# EAGLE schematic AcquisitionExpansionModule (EAGLE 6.6.0)
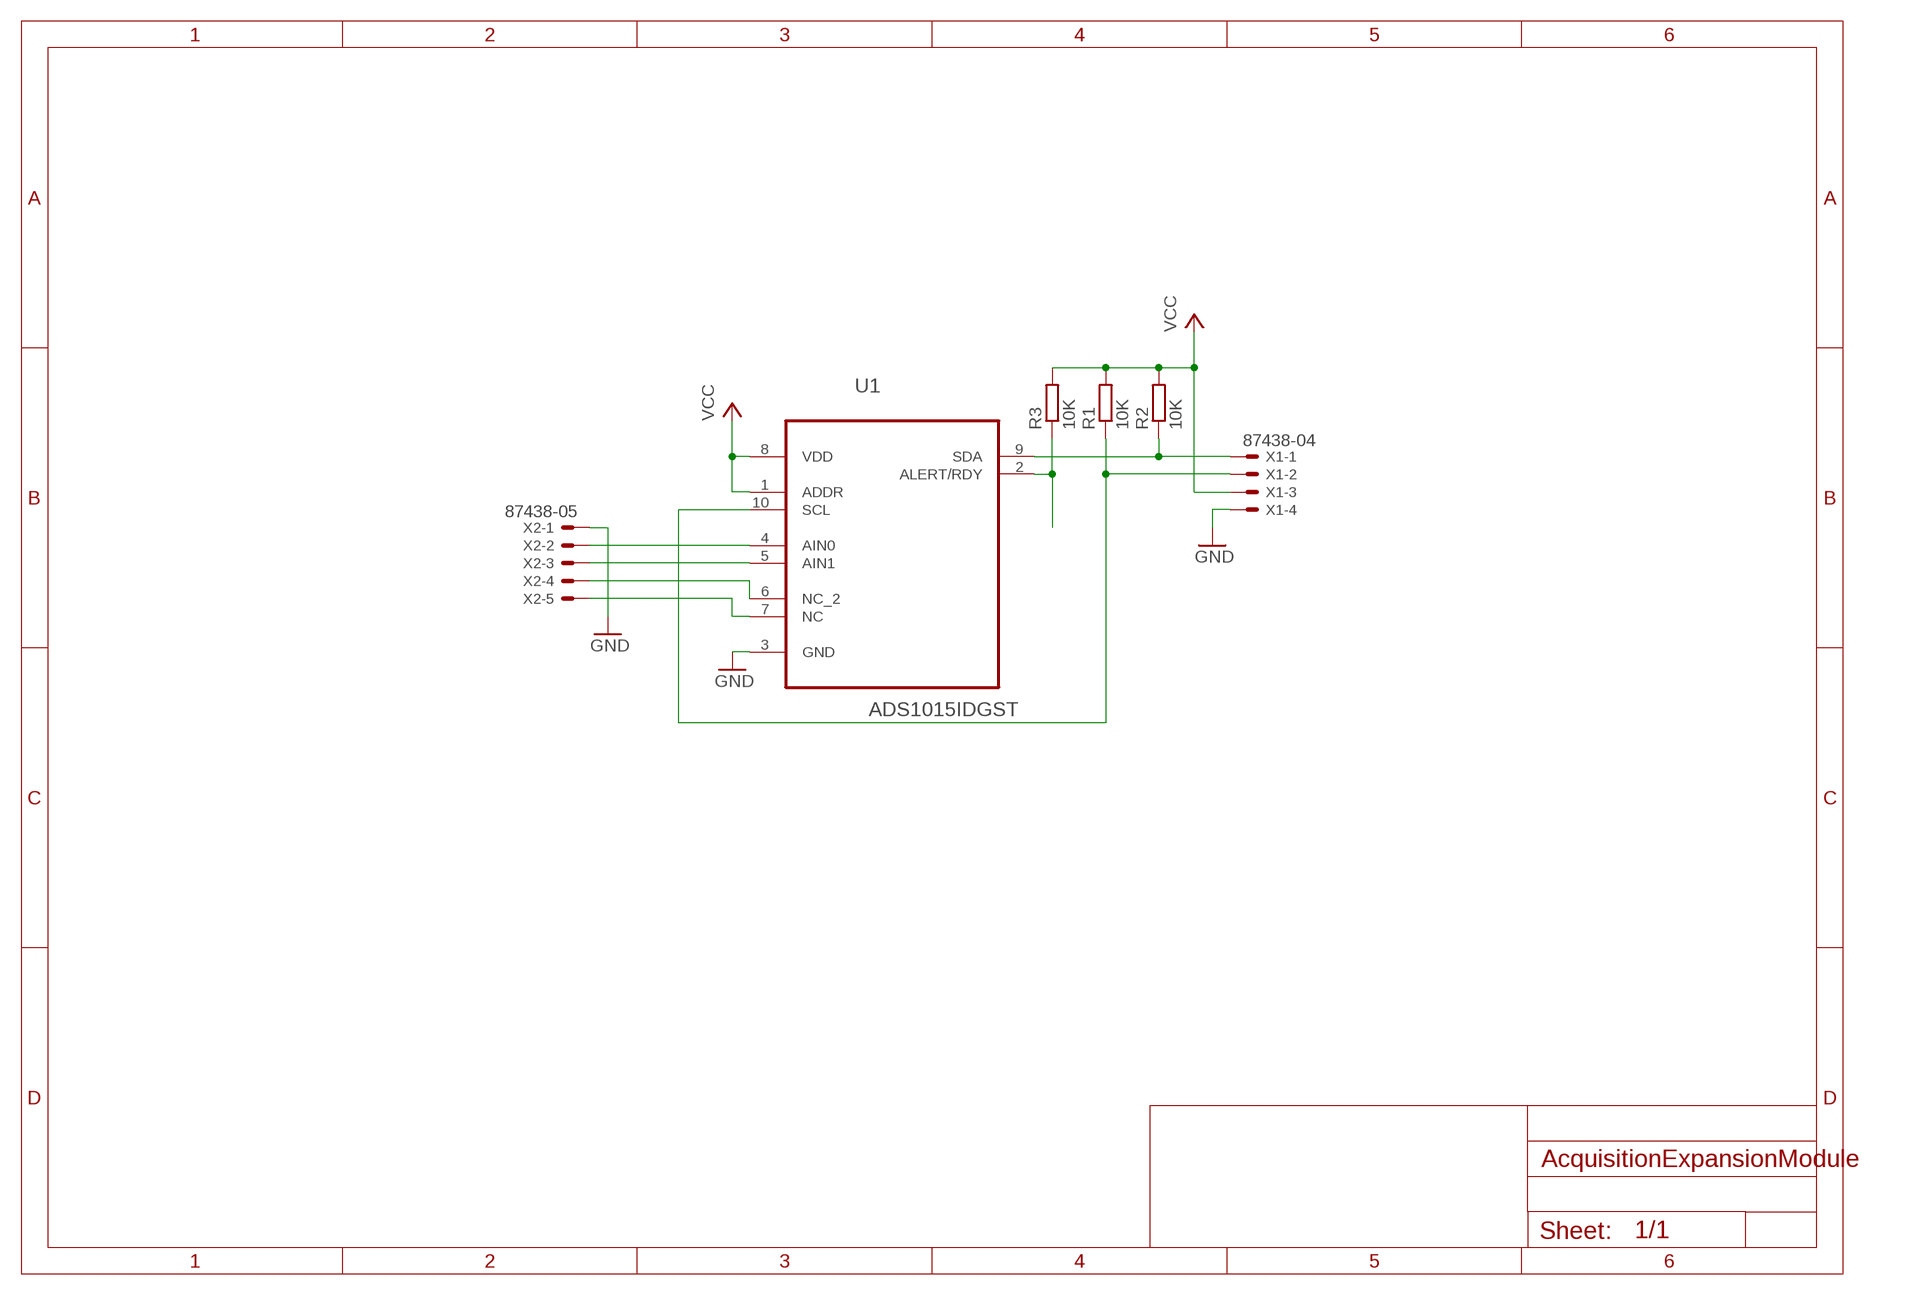
[diagram p0: schematic, sheet 1]

## Parts
R1  10K  R-EU_MELF0102W  [MINI_MELF-0102W]
R2  10K  R-EU_MELF0102W  [MINI_MELF-0102W]
R3  10K  R-EU_MELF0102W  [MINI_MELF-0102W]
U1  ADS1015IDGST  [SOP50P490X110-10N]
X1  87438-04  [87438-04]
X2  87438-05  [87438-05]

## Nets
GND: U1.3(GND) X1.4 X2.1
N$1: R2.1 U1.9(SDA) X1.1
N$2: R1.1 U1.10(SCL) X1.2
N$3: U1.7(NC) X2.5
N$4: U1.6(NC_2) X2.4
N$5: U1.5(AIN1) X2.3
N$6: U1.4(AIN0) X2.2
N$7: R3.1 U1.2(ALERT/RDY)
VCC: R1.2 R2.2 R3.2 U1.1(ADDR) U1.8(VDD) X1.3

## Library data of the parts
R1-R3 = resistor:R-EU_: RESISTOR, European symbol
U1 = ADS1015:ADS1015IDGST: Ultra-Small, Low-Power, 12-Bit Analog-to-Digital Converter with Internal Reference; MPN: ADS1015IDGST; OC_FARNELL: 1778211; OC_NEWARK: 35R0211; PACKAGE: MSOP-10; SUPPLIER: Texas Instruments
X1 = con-molex:87438-04: Wire-to-Board 1.50mm (.059") Pitch Header - Right Angle, SMT, Shrouded Source: http://www.molex.com/product/micro/87438.html; OC_FARNELL: unknown; OC_NEWARK: unknown
X2 = con-molex:87438-05: Wire-to-Board 1.50mm (.059") Pitch Header - Right Angle, SMT, Shrouded Source: http://www.molex.com/product/micro/87438.html; MPN: 87438-0542; OC_FARNELL: unknown; OC_NEWARK: 94M1090